# EAGLE design irsensorwafer (EAGLE 8.2.1)
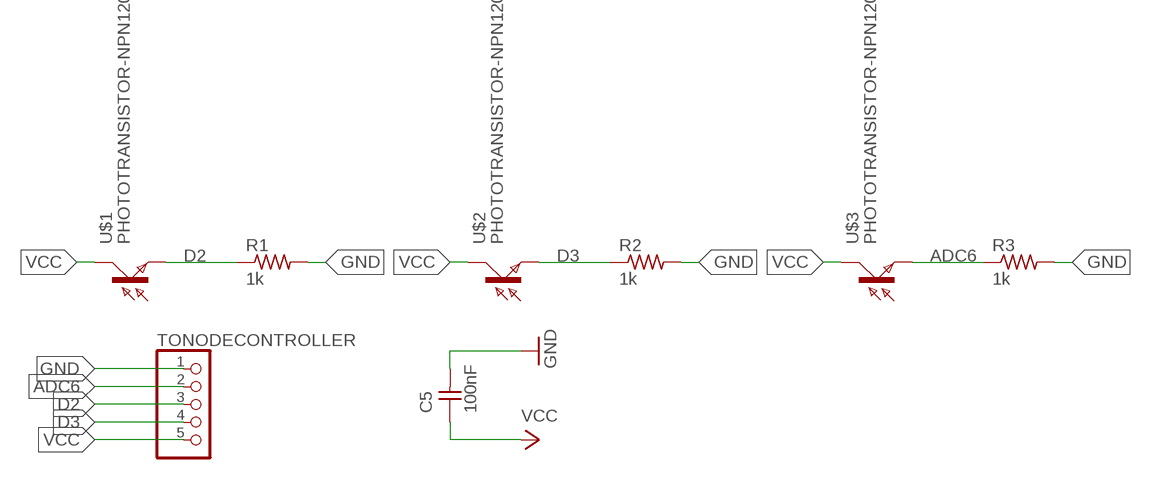
[diagram p0: schematic, sheet 1]

## Parts
C5  100nF  CAP-UNPOLARIZEDFAB  [C1206FAB]
R1  1k  RES-US1206FAB  [R1206FAB]
R2  1k  RES-US1206FAB  [R1206FAB]
R3  1k  RES-US1206FAB  [R1206FAB]
TONODECONTROLLER  PINHD-1X5  [1X05]
U$1  PHOTOTRANSISTOR-NPN1206  [OP1206]
U$2  PHOTOTRANSISTOR-NPN1206  [OP1206]
U$3  PHOTOTRANSISTOR-NPN1206  [OP1206]

## Nets
ADC6: R3.1 TONODECONTROLLER.2 U$3.EMITTER(E)
D2: R1.1 TONODECONTROLLER.3 U$1.EMITTER(E)
D3: R2.1 TONODECONTROLLER.4 U$2.EMITTER(E)
GND: C5.2 R1.2 R2.2 R3.2 TONODECONTROLLER.1
VCC: C5.1 TONODECONTROLLER.5 U$1.COLLECTOR(C) U$2.COLLECTOR(C) U$3.COLLECTOR(C)

## Library data of the parts
C5 = fab:CAP-UNPOLARIZED
R1-R3 = fab:RES-US: Resistor (US Symbol) Variants with postfix FAB are widened to allow the routing of internal traces
TONODECONTROLLER = pinhead:PINHD-1X5: PIN HEADER
U$1-U$3 = fab:PHOTOTRANSISTOR-NPN

## Board
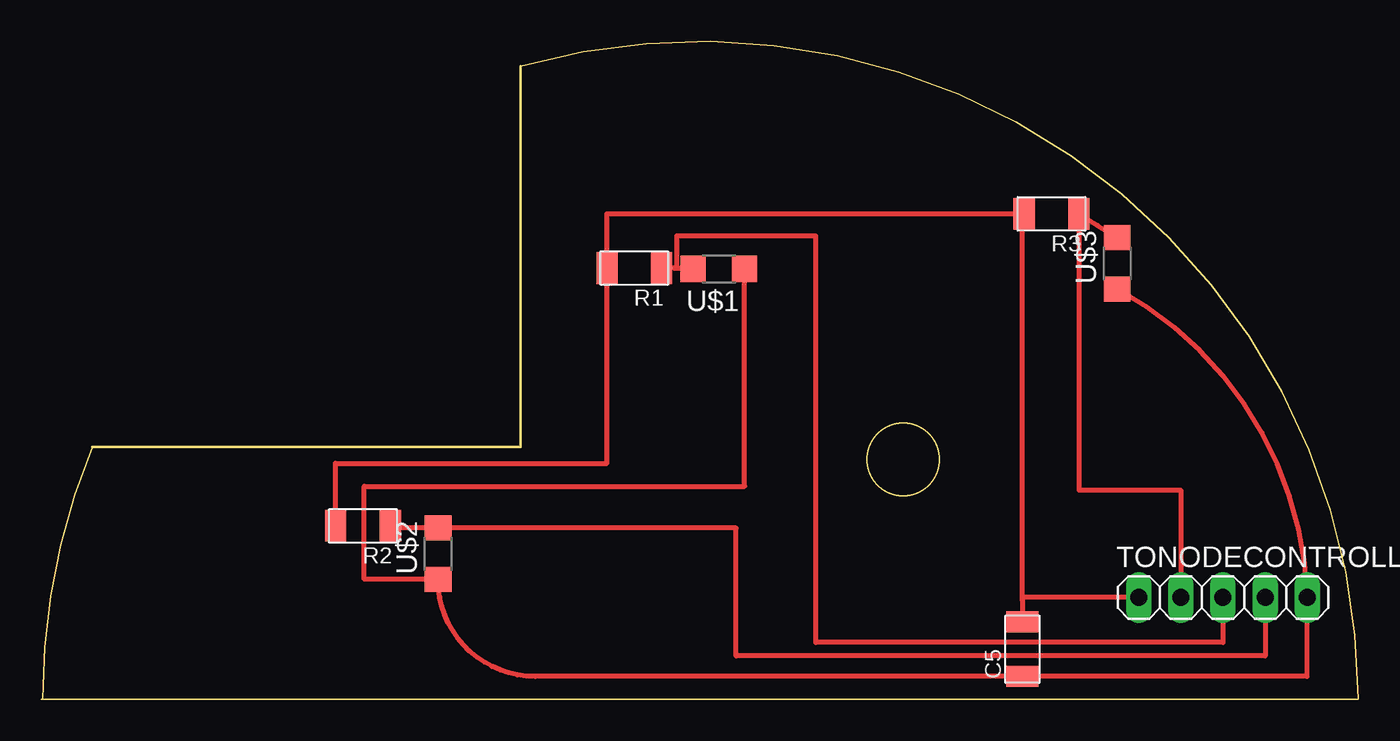
[diagram p1: board, top side]

Size 79.37 x 39.66 mm. Coordinates in mm from the lower left corner, seen from the top.
Outline: 79.37,0 0,0
Outline: 39.69,0.01 25.67,0.01
Outline: 28.87,15.22 3.06,15.22 3.05,15.21
Outline: 28.89,15.22 28.89,38.16 28.89,38.17
Outline: 0.06,0.02 arc-23 3.1,15.23
Outline: 79.37,0.02 arc106 28.89,38.16
Outline: circle at 51.94,14.47 radius 2.19
Copper layers (1*16): Top 0.035mm / dielectric 1.5mm / Bottom 0.035mm
Design rules "default *": minimum track width 12mil, minimum drill 24mil, track to track 16mil, track to pad 16mil, pad to pad 16mil, via to via 16mil, smd to smd 16mil, copper to edge 40mil, drill to drill 8mil, minimum pad ring 10mil, minimum via ring 8mil, stop-mask expansion 4mil, vias tented up to drill 0mil, thermal gap 10mil

### Footprints (pad centres in the part's own frame; a part is rotated, then mirrored left to right if it is on the bottom)
C1206FAB = smd 1.27 x 1.905: 1 -1.651,0; 2 1.651,0
R1206FAB = smd 1.27 x 1.905: 1 -1.651,0; 2 1.651,0
1X05 = drill 1.016 long: 1 -5.08,0; 2 -2.54,0; 3 0,0; 4 2.54,0; 5 5.08,0
OP1206 = smd 1.5 x 1.6: COLLECTOR -1.55,0; EMITTER 1.55,0

### Placement (x,y rotation side)
C5  59.13,3.02 90 top
R1  35.74,26 180 top
R2  19.38,10.46 180 top
R3  60.89,29.27 180 top
TONODECONTROLLER  71.23,6.13 0 top
U$1  40.83,25.94 180 top
U$2  23.91,8.78 90 top
U$3  64.85,26.29 90 top

### Tracks (layer width: path | path; a pad name or v marks a point on that pad's centre or on a via)
ADC6
  Top 0.305: U$3.EMITTER 63.66,28.57 R3.1 62.54,12.61 68.68,12.61 TONODECONTROLLER.2
D2
  Top 0.305: 37.39,25.84 R1.1 38.13,26 | 38.13,26 39.28,26 U$1.EMITTER | TONODECONTROLLER.3 71.23,3.42 46.68,3.42 46.68,27.93 38.29,27.93 38.29,26 38.13,26
D3
  Top 0.305: R2.1 arc90 21.16,10.33 U$2.EMITTER 41.88,10.33 41.88,2.61 73.77,2.61 TONODECONTROLLER.4
GND
  Top 0.305: 59.13,5.92 C5.2 59.13,4.73 | 59.13,5.92 59.13,29.16 R3.2 34.08,29.27 R1.2 34.09,14.22 17.73,14.22 R2.2 | TONODECONTROLLER.1 59.13,6.13 59.13,5.92
VCC
  Top 0.305: U$3.COLLECTOR arc-60 TONODECONTROLLER.5 76.31,1.37 C5.1 29.77,1.37 arc-90 U$2.COLLECTOR 19.45,7.23 19.45,12.84 42.38,12.84 U$1.COLLECTOR